# EAGLE design GPIB2EDGE Rev 1 (EAGLE 9.7.0)
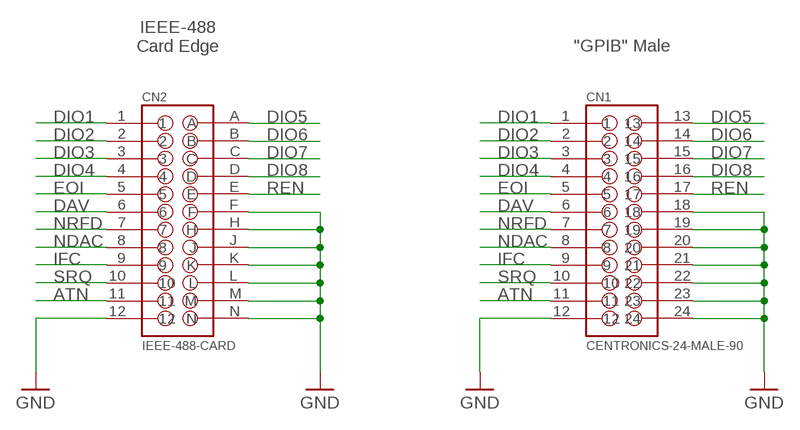
[diagram p0: schematic, sheet 1]

## Parts
CN1  CENTRONICS-24-MALE-90  [CENTRONICS-24-M-90]
CN2  IEEE-488-CARD  [IEEE-488-EDGE-CARD]

## Nets
ATN: CN1.11 CN2.11
DAV: CN1.6 CN2.6
DIO1: CN1.1 CN2.1
DIO2: CN1.2 CN2.2
DIO3: CN1.3 CN2.3
DIO4: CN1.4 CN2.4
DIO5: CN1.13 CN2.A
DIO6: CN1.14 CN2.B
DIO7: CN1.15 CN2.C
DIO8: CN1.16 CN2.D
EOI: CN1.5 CN2.5
GND: CN1.12 CN1.18 CN1.19 CN1.20 CN1.21 CN1.22 CN1.23 CN1.24 CN2.12 CN2.F CN2.H CN2.J CN2.K CN2.L CN2.M CN2.N
IFC: CN1.9 CN2.9
NDAC: CN1.8 CN2.8
NRFD: CN1.7 CN2.7
REN: CN1.17 CN2.E
SRQ: CN1.10 CN2.10

## Notes on the sheet
- IEEE-488
  Card Edge
- "GPIB" Male

## Library data of the parts
CN1 = Per (Fusion 360):CENTRONICS-24-MALE
CN2 = Per (Fusion 360):IEEE-488

## Board
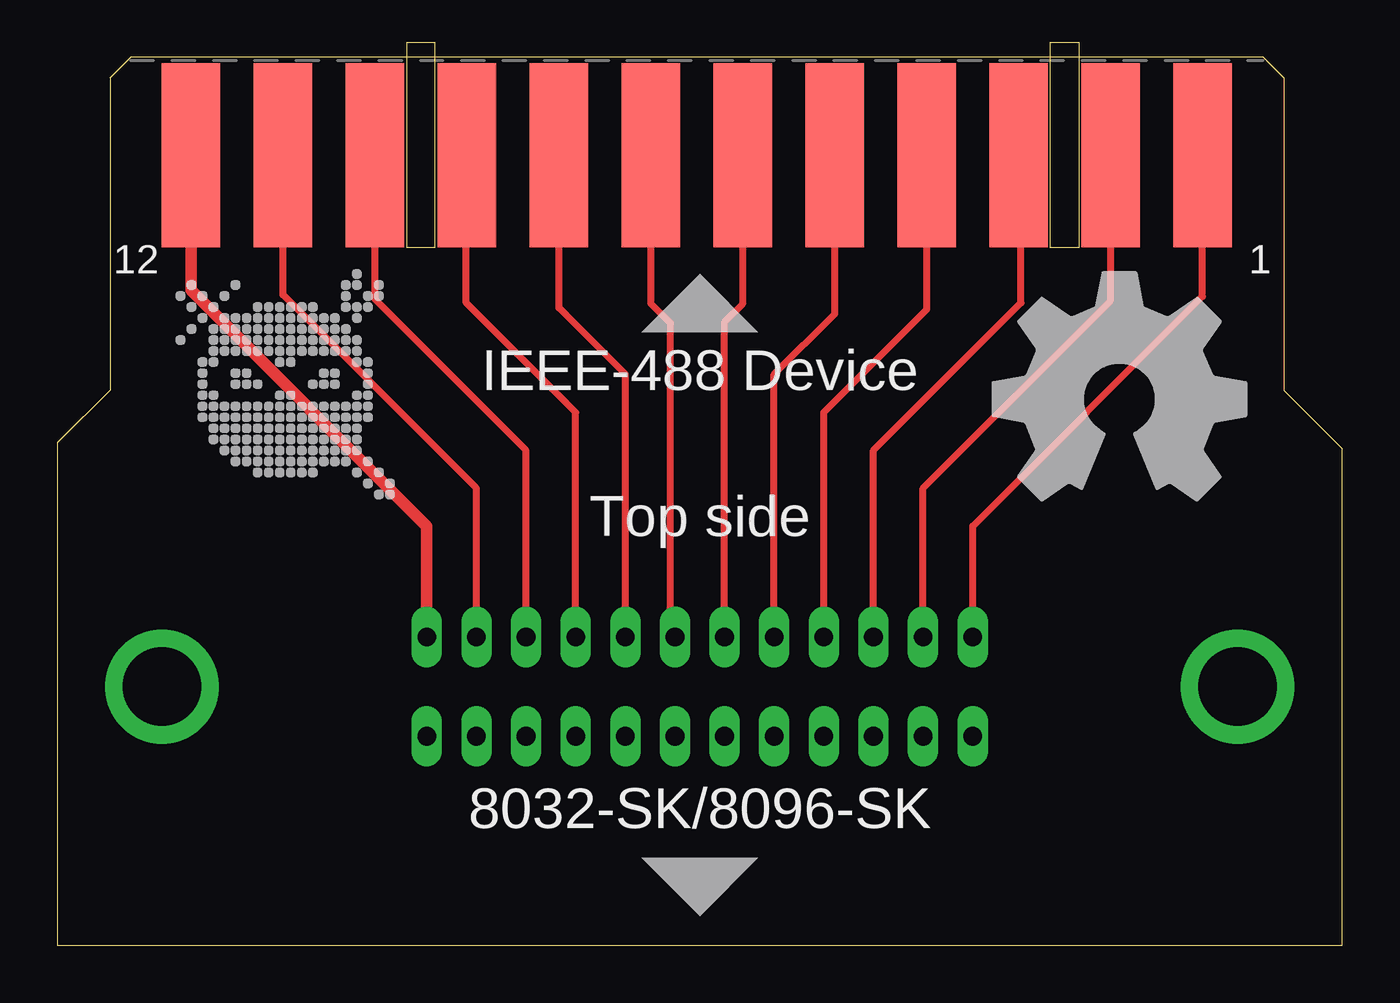
[diagram p1: board, top side]
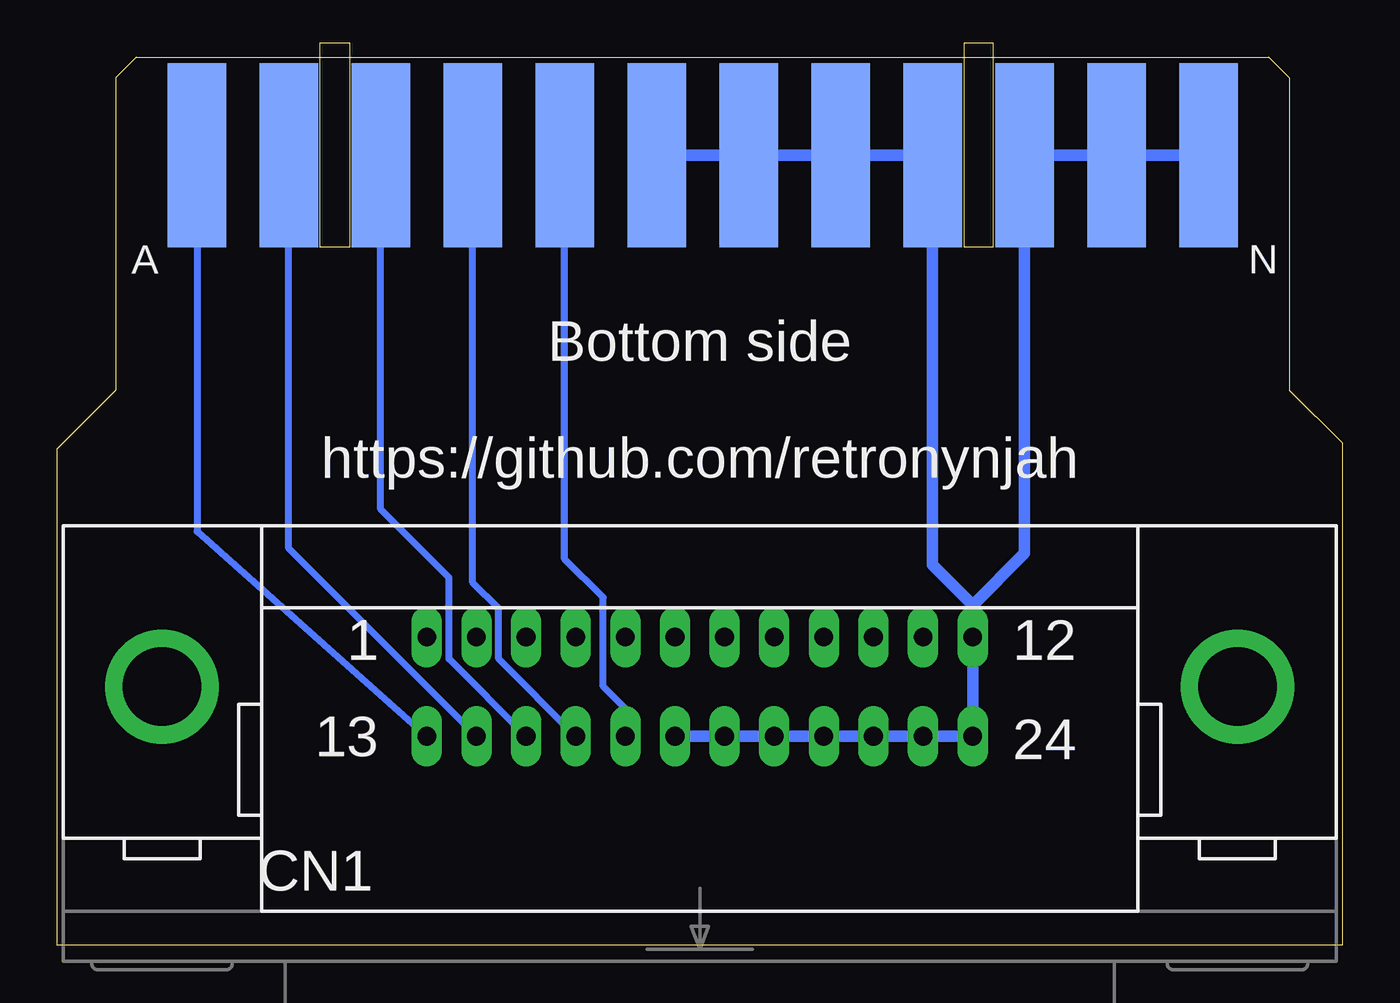
[diagram p2: board, bottom side, seen from below]

Size 55.88 x 38.61 mm. Coordinates in mm from the lower left corner, seen from the top.
Outline: 0,0 55.88,0 55.88,21.59 53.34,24.13 53.34,37.72 52.45,38.61 3.17,38.61 2.29,37.72 2.29,24.13 0,21.84 0,0
Copper layers (1*16): Top / Bottom
Stack-up Default Layer Stack: Top User Defined 0.035mm / Dielectric-1 User Defined 1.5mm / Bottom User Defined 0.035mm
Design rules "SeeedStudio_2layer_DRU_no_angle_20140221": minimum track width 6mil, minimum drill 12mil, track to track 6mil, track to pad 6mil, pad to pad 6mil, via to via 6mil, smd to smd 0mil, copper to edge 10mil, drill to drill 10mil, minimum pad ring 10mil, minimum via ring 6mil, stop-mask expansion 2mil, vias tented up to drill 100mil, thermal gap 10mil

### Footprints (pad centres in the part's own frame; a part is rotated, then mirrored left to right if it is on the bottom)
CENTRONICS-24-M-90 = drill 0.813 long: 1 11.874,-2.159; 2 9.716,-2.159; 3 7.556,-2.159; 4 5.397,-2.159; 5 3.239,-2.159; 6 1.079,-2.159; 7 -1.079,-2.159; 8 -3.239,-2.159; 9 -5.397,-2.159; 10 -7.556,-2.159; 11 -9.716,-2.159; 12 -11.874,-2.159; 13 11.874,2.159; 14 9.716,2.159; 15 7.556,2.159; 16 5.397,2.159; 17 3.239,2.159; 18 1.079,2.159; 19 -1.079,2.159; 20 -3.239,2.159; 21 -5.397,2.159; 22 -7.556,2.159; 23 -9.716,2.159; 24 -11.874,2.159 | drill 3.429 pad 4.953: P$1 -23.393,0; P$2 23.393,0
IEEE-488-EDGE-CARD = smd 2.54 x 8: 1 22,0.19; 2 18,0.19; 3 14,0.19; 4 10,0.19; 5 6,0.19; 6 2,0.19; 7 -2,0.19; 8 -6,0.19; 9 -10,0.19; 10 -14,0.19; 11 -18,0.19; 12 -22,0.19 | smd 2.54 x 8 bottom: A 22,0.19; B 18,0.19; C 14,0.19; D 10,0.19; E 6,0.19; F 2,0.19; H -2,0.19; J -6,0.19; K -10,0.19; L -14,0.19; M -18,0.19; N -22,0.19

### Placement (x,y rotation side)
CN1  27.94,11.25 180 bottom
CN2  27.81,34.16 0 top
U$1  [OSHW_NOTEXT_10MM]  40.64,19.3 0 top
U$2  [RETRONINJA_NOTEXT_10MM]  9.91,24.64 0 top

### Tracks (layer width: path | path; a pad name or v marks a point on that pad's centre or on a via)
ATN
  Top 0.305: CN1.11 18.22,19.88 9.81,28.29 CN2.11
DAV
  Top 0.305: CN1.6 29.02,27.11 29.81,27.91 CN2.6
DIO1
  Top 0.305: CN1.1 39.81,18.22 49.81,28.22 CN2.1
DIO2
  Top 0.305: CN1.2 37.66,19.88 45.81,28.03 CN2.2
DIO3
  Top 0.305: CN1.3 35.5,21.53 41.91,27.94 41.91,34.26 CN2.3
DIO4
  Top 0.305: CN1.4 33.34,23.18 37.81,27.65 CN2.4
DIO5
  Bottom 0.305: CN1.13 49.81,18 CN2.A
DIO6
  Bottom 0.305: CN1.14 45.81,17.26 CN2.B
DIO7
  Bottom 0.305: CN2.C 41.81,18.95 38.85,15.99 38.85,12.45 CN1.15
DIO8
  Bottom 0.305: CN2.D 37.81,15.77 36.69,14.65 36.69,12.45 CN1.16
EOI
  Top 0.305: CN1.5 31.18,24.83 33.81,27.46 CN2.5
GND
  Top 0.508: CN2.N 5.81,28.48 16.07,18.22 CN1.12
  Bottom 0.508: CN1.18 CN1.19 CN1.20 CN1.21 CN1.22 CN1.23 CN1.24 CN1.12 16.07,14.8 | 16.07,14.8 17.81,16.54 CN2.K CN2.J CN2.H CN2.F | CN2.N CN2.M CN2.L 13.81,17.05 16.07,14.8
IFC
  Top 0.305: CN1.9 22.54,23.18 17.78,27.94 17.78,34.32 CN2.9
NDAC
  Top 0.305: CN1.8 24.7,24.83 21.81,27.72 CN2.8
NRFD
  Top 0.305: CN1.7 26.67,12.51 26.67,27.05 25.81,27.91 CN2.7
REN
  Bottom 0.305: CN2.E 33.81,16.8 32.14,15.13 32.14,11.26 31.18,10.29 CN1.17
SRQ
  Top 0.305: CN1.10 20.38,21.53 13.81,28.1 CN2.10

### Text on the board
tPlace: 12 | 1 | IEEE-488 Device | Top side | 8032-SK/8096-SK
bPlace: N | A | Bottom side | https://github.com/retronynjah